# EAGLE schematic photoFrame (EAGLE 9.3.0)
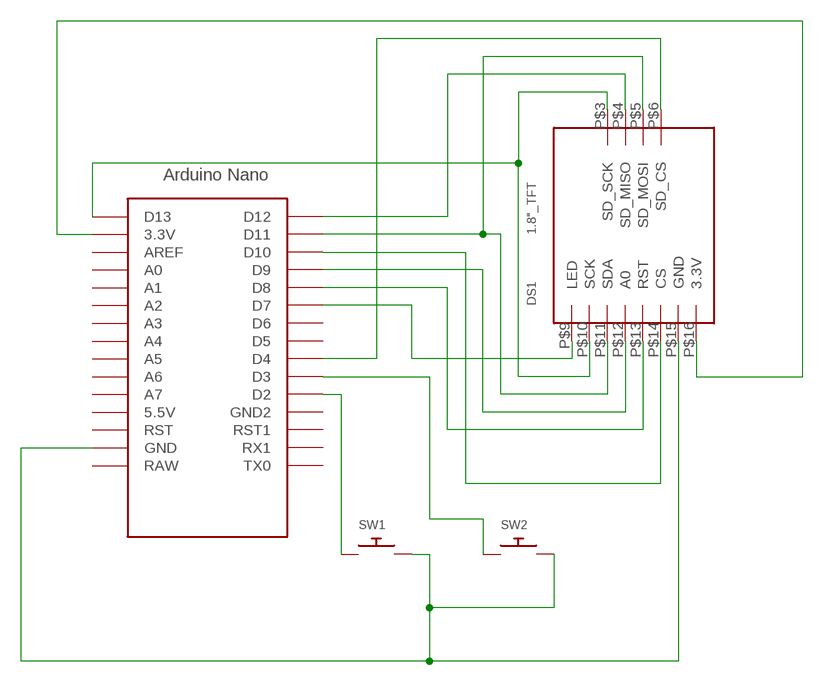
[diagram p0: schematic, sheet 1]

## Parts
DS1  1.8"_TFT  [1.8"_TFT]
SW1  SWITCH_PUSHBUTTONC&K_KSS  [BTN_CK_KSS]
SW2  SWITCH_PUSHBUTTONC&K_KSS  [BTN_CK_KSS]
U1  NANO  [NANO]

## Nets
N$1: DS1.P$16(3.3V) U1.3.3V
N$2: DS1.P$15(GND) SW1.P$2 SW2.P$2 U1.GND
N$3: DS1.P$14(CS) U1.D10
N$4: DS1.P$13(RST) U1.D8
N$5: DS1.P$12(A0) U1.D9
N$6: DS1.P$5(SD_MOSI) DS1.P$11(SDA) U1.D11
N$7: DS1.P$3(SD_SCK) DS1.P$10(SCK) U1.D13
N$8: DS1.P$6(SD_CS) U1.D4
N$9: SW1.P$1 U1.D2
N$10: DS1.P$4(SD_MISO) U1.D12
N$11: SW2.P$1 U1.D3
N$12: DS1.P$9(LED) U1.D7
Unconnected: U1.5V(5.5V) U1.A0 U1.A1 U1.A2 U1.A3 U1.A4 U1.A5 U1.A6 U1.A7 U1.AREF U1.D5 U1.D6 U1.GND1(GND2) U1.ICSP1 U1.ICSP2 U1.ICSP3 U1.ICSP4 U1.ICSP5 U1.ICSP6 U1.RAW U1.RST U1.RST1 U1.RX1 U1.TX0

## Library data of the parts
DS1 = tft_1.8_1.44_oled_0.96:1.8"_TFT
SW1 SW2 = adafruit:SWITCH_PUSHBUTTON: Buttons SOFTTOUCHSMD_SJ - Soft touch temporary push button (Super Junk Akihabara) Compatible with SKPMANE010 [Mouser: 688-SKPMAN] C&K_KSS = Digikey: KSS221GLFS
U1 = Arduino-clone:NANO: Arduino Nano